# Altium schematic sheet 03 POWER DIAGRAM.SchDoc
size A2; ApprovedBy: DNP; CheckedBy: DNP; Author: DNP; CompanyName: Google LLC; DrawnBy: DNP; Organization: Google LLC; Address1: 1600 Amphitheatre Parkway; Address2: Mountain View, CA 94043; Address3: DNP; Address4: DNP; DocumentNumber: 3; SheetNumber: 3; SheetTotal: 17; VersionControl_RevNumber: DNP; IsUserConfigurable: DNP; Time: DNP; ImagePath: DNP; Rule: DNP; ProjectName: Enterprise; Application_BuildNumber: DNP
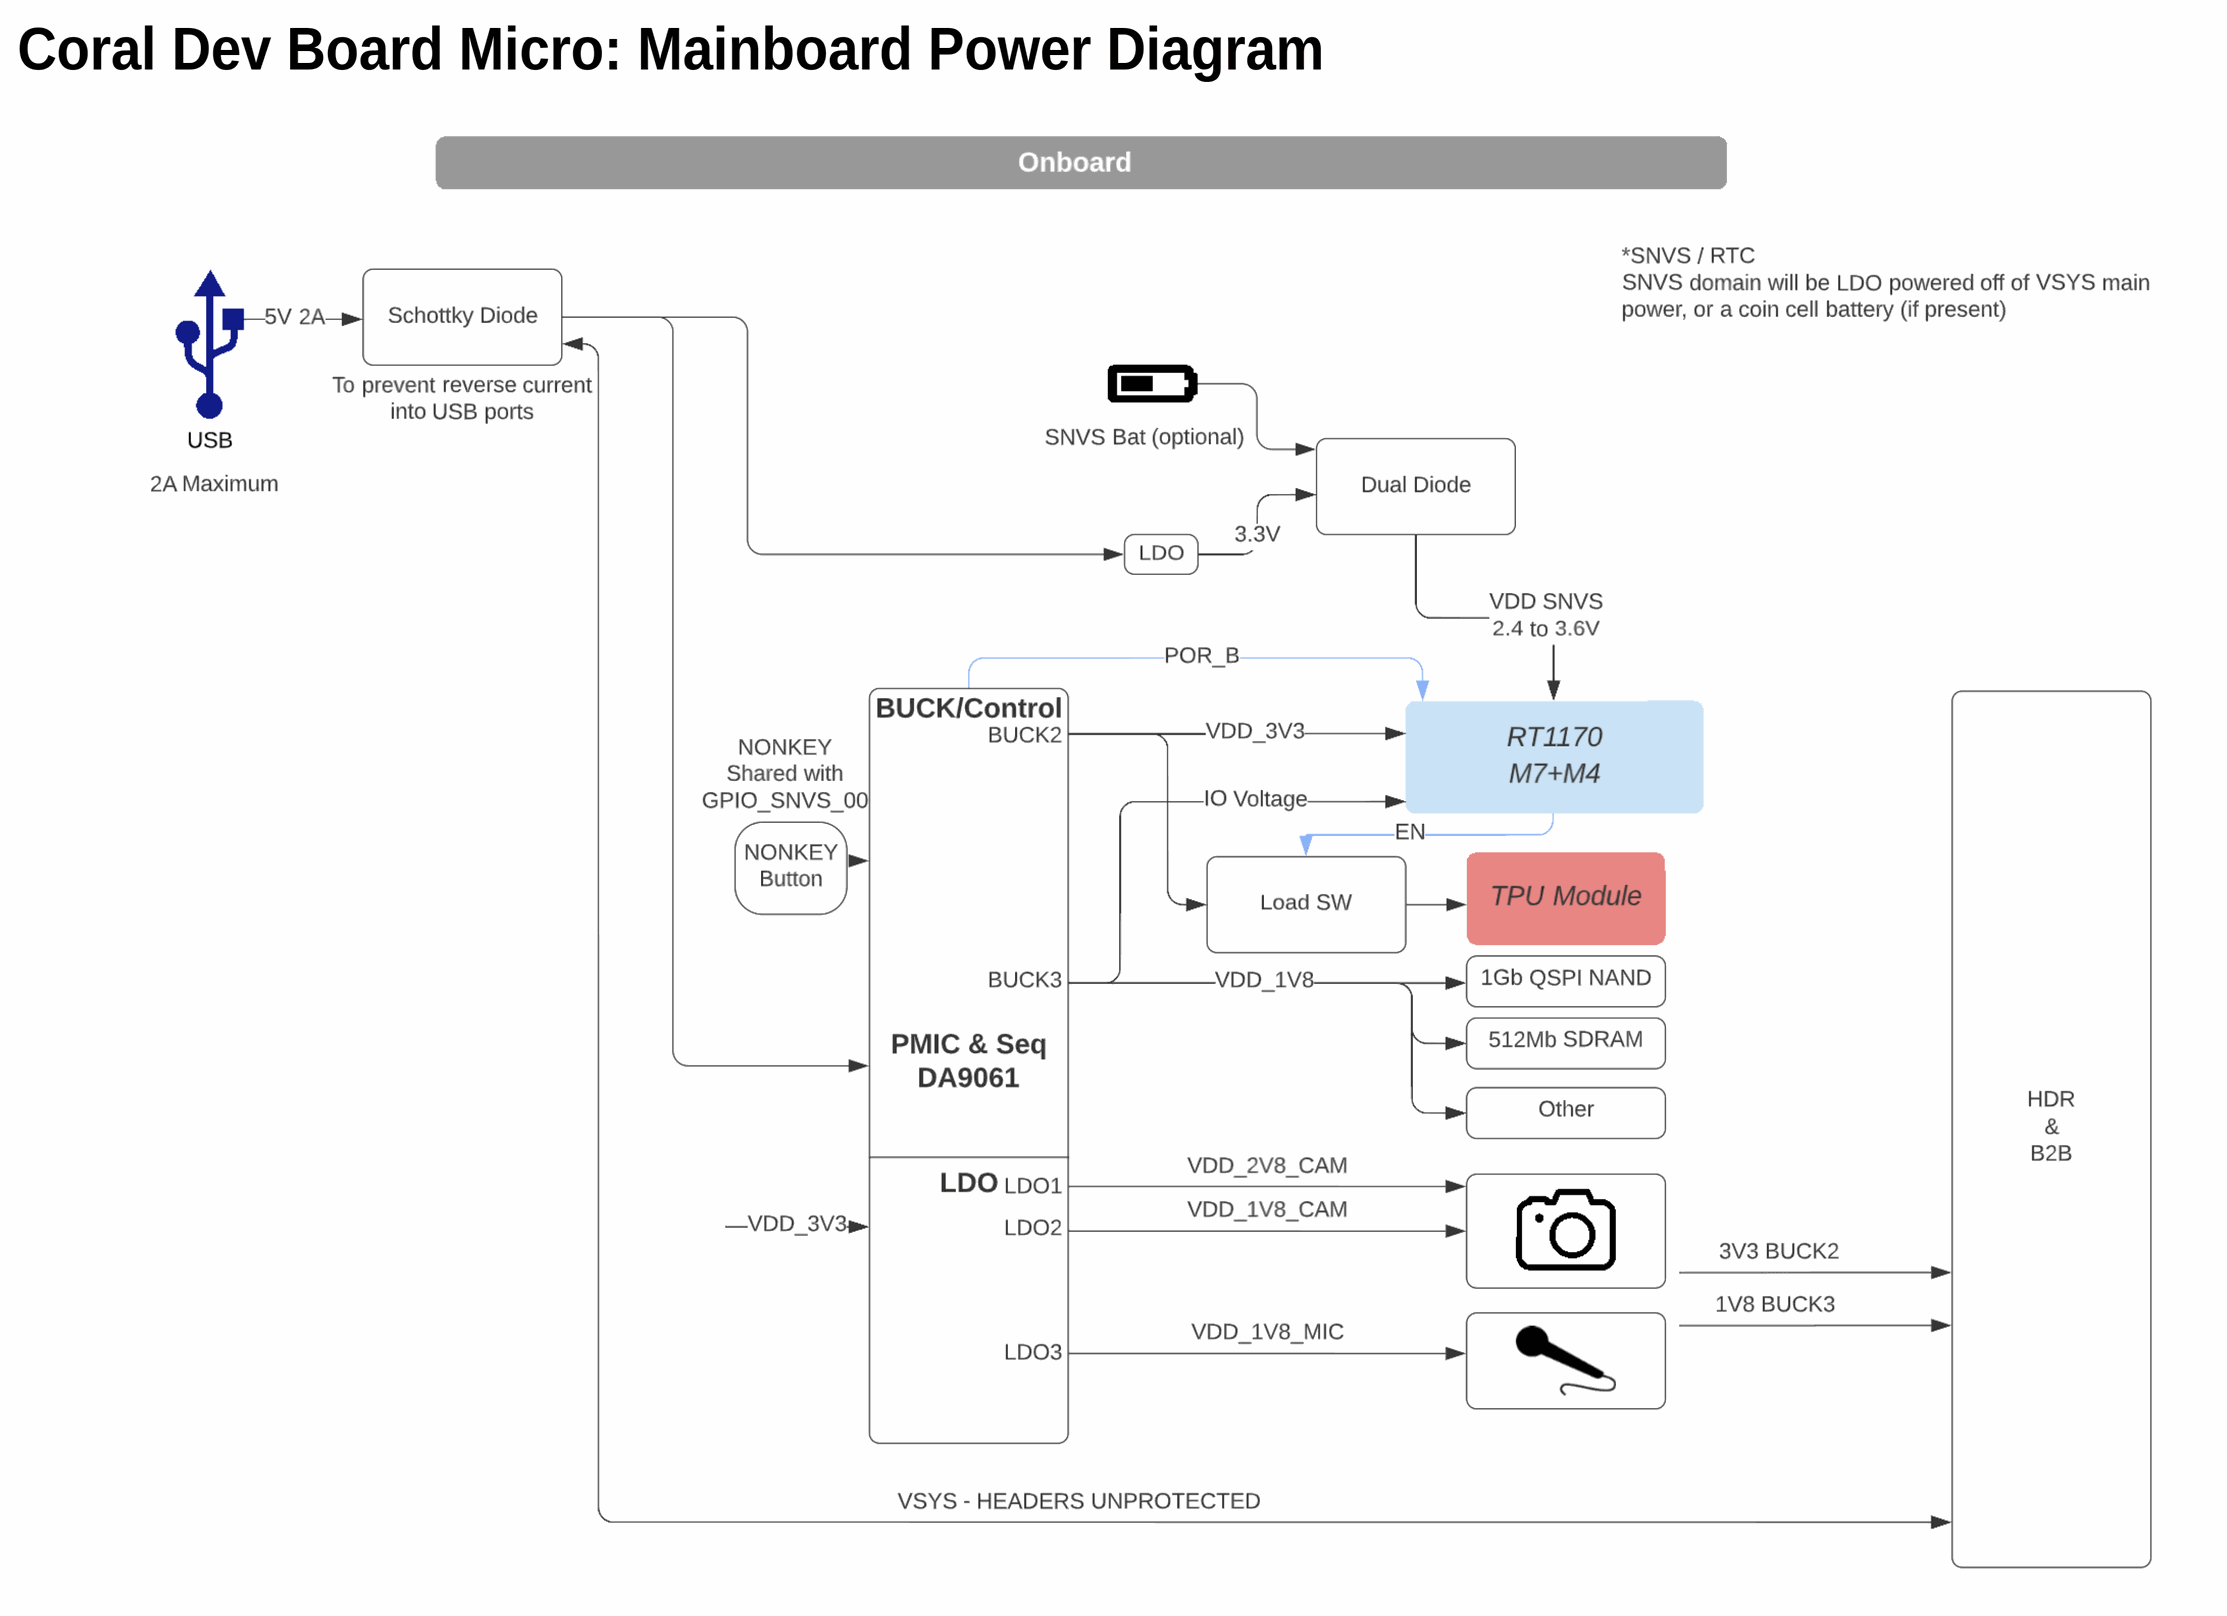
[diagram p0: 03 POWER DIAGRAM.SchDoc]

## Notes on the sheet
- Coral Dev Board Micro: Mainboard Power Diagram
- Project:
- Engineer:
- Date:
- File:
- Revision:
- Sheet
- of